# Altium schematic sheet Sheet1.SchDoc: FHGR_A3_landscape
size A3; Date: 18.07.2017; DrawnBy: G.P. Catregn; Organization: HTW Chur; Address1: Pulvermühlestrasse 57; Address2: 7004 Chur; Address3: Switzerland; DocumentNumber: 1; Revision: V1.0; SheetNumber: 1; SheetTotal: 2; DocumentName: HTW Template
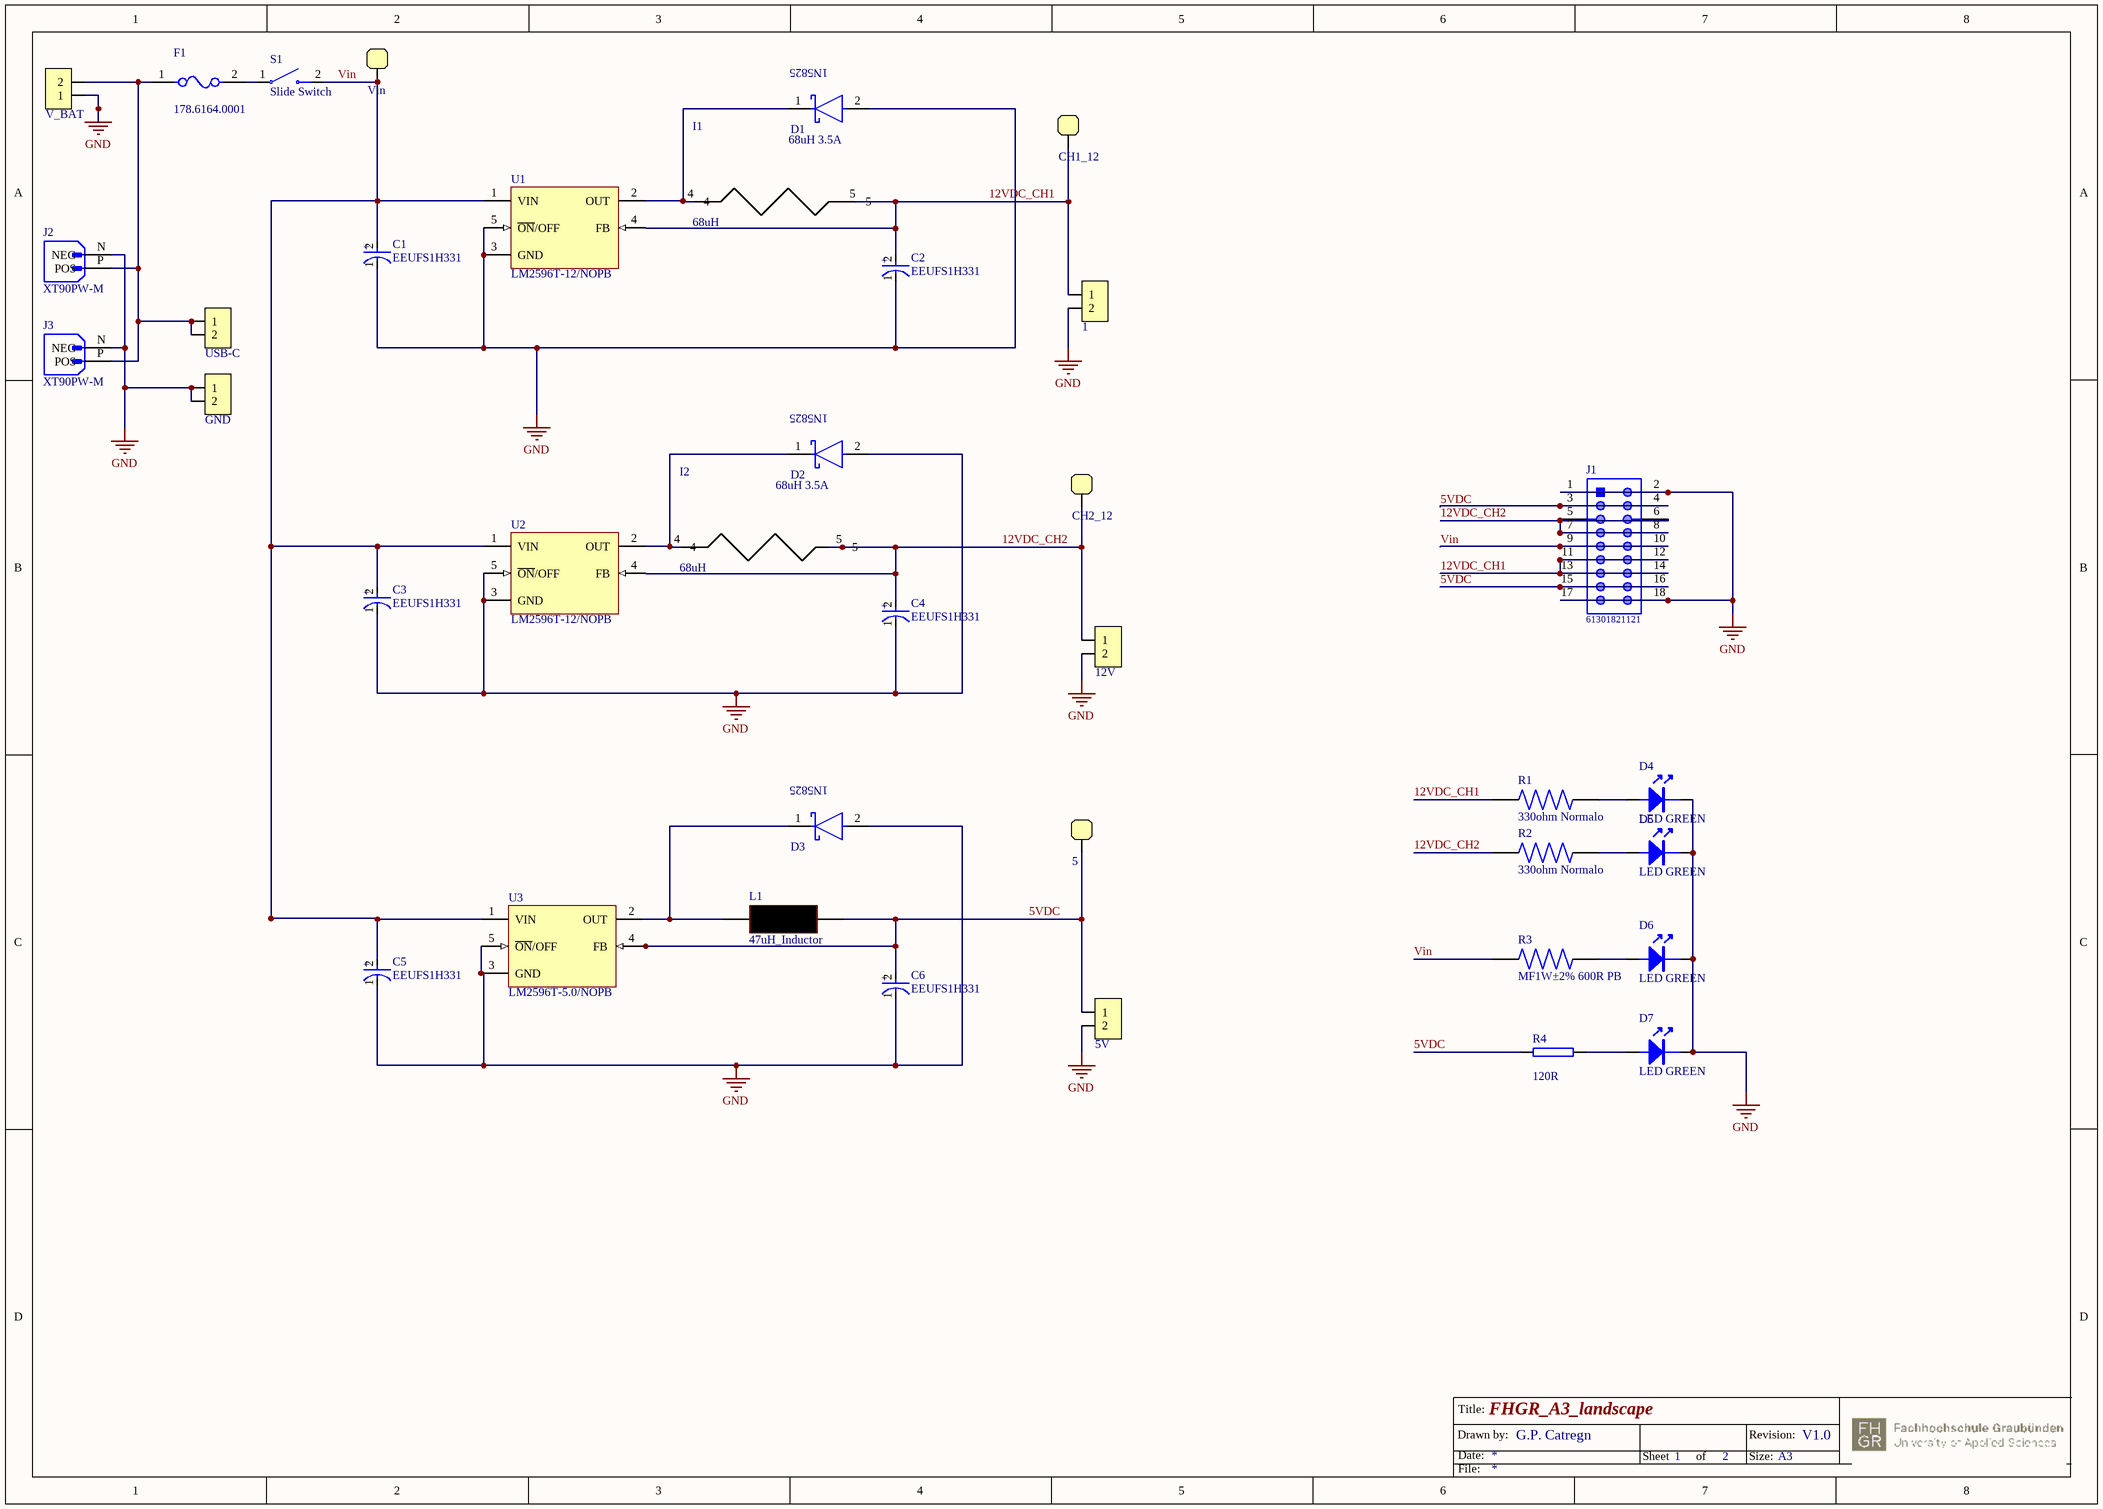
[diagram p0: Sheet1.SchDoc]

## Parts
1  2Pin_Female  [OSTTE020104]  (value not drawn)
5  MP  [MP_20]  (value not drawn)
5V  2Pin_Female  [OSTTE020104]  (value not drawn)
12V  2Pin_Female  [OSTTE020104]  (value not drawn)
C1  EEUFS1H331  [FP-RAD-TH-D_10_0_5-L_20_2-MFG]
C2  EEUFS1H331  [FP-RAD-TH-D_10_0_5-L_20_2-MFG]
C3  EEUFS1H331  [FP-RAD-TH-D_10_0_5-L_20_2-MFG]
C4  EEUFS1H331  [FP-RAD-TH-D_10_0_5-L_20_2-MFG]
C5  EEUFS1H331  [FP-RAD-TH-D_10_0_5-L_20_2-MFG]
C6  EEUFS1H331  [FP-RAD-TH-D_10_0_5-L_20_2-MFG]
CH1_12  MP  [MP_20]  (value not drawn)
CH2_12  MP  [MP_20]  (value not drawn)
D1  1N5825  [Microsemi_1N5825_0]  (value not drawn)
D2  1N5825  [Microsemi_1N5825_0]  (value not drawn)
D3  1N5825  [Microsemi_1N5825_0]  (value not drawn)
D4  LED GREEN  [LED_1206]
D5  LED GREEN  [LED_1206]
D6  LED GREEN  [LED_1206]
D7  LED GREEN  [LED_1206]
F1  178.6164.0001  [FP-178_6164_0001-MFG]
GND  2Pin_Male  [Header1x2_254]  (value not drawn)
I1  68uH  [PCBComponent_1]
I2  68uH  [PCBComponent_1]
J1  61301821121  [61301821121]
J2  XT90PW-M  [AMASS_XT90PW-M]
J3  XT90PW-M  [AMASS_XT90PW-M]
L1  47uH_Inductor  [INDM120120X100N]
R1  330ohm Normalo  [RESAD1100W55L680D260]
R2  330ohm Normalo  [RESAD1100W55L680D260]
R3  MF1W±2% 600R PB  [RESAD1100W55L680D260]
R4  value 120R  [0805]  (hidden comment: R 120R 0805)
S1  Slide Switch  [SW_GF_123_0054]
U1  LM2596T-12/NOPB  [NDH0005A]
U2  LM2596T-12/NOPB  [NDH0005A]
U3  LM2596T-5.0/NOPB  [NDH0005A]
USB-C  2Pin_Male  [Header1x2_254]  (value not drawn)
V_BAT  2Pin_Female  [OSTTE020104]  (value not drawn)
Vin  MP  [MP_20]  (value not drawn)

## Nets
GND: 1.2 5V.2 12V.2 C1.1(C) C2.1(C) C3.1(C) C4.1(C) C5.1(C) C6.1(C) D1.2(A) D2.2(A) D3.2(A) D4.K D5.K D6.K D7.K GND.1 GND.2 J1.1 J1.2 J1.17 J1.18 J2.N(NEG) J3.N(NEG) U1.3(GND) U1.5(~{ON}/OFF) U2.3(GND) U2.5(~{ON}/OFF) U3.3(GND) U3.5(~{ON}/OFF) V_BAT.1
5VDC: 5.1 5V.1 C6.2(A) J1.3 J1.4 J1.15 J1.16 L1.2 R4.1 U3.4(FB)
12VDC_CH1: 1.1 C2.2(A) CH1_12.1 I1.5 J1.11 J1.12 J1.13 J1.14 R1.1 U1.4(FB)
12VDC_CH2: 12V.1 C4.2(A) CH2_12.1 I2.5 J1.5 J1.6 J1.7 J1.8 R2.1 U2.4(FB)
Vin: C1.2(A) C3.2(A) C5.2(A) J1.9 J1.10 R3.1 S1.2(C) U1.1(VIN) U2.1(VIN) U3.1(VIN) Vin.1
NetD1_1: D1.1(C) I1.4 U1.2(OUT)
NetD2_1: D2.1(C) I2.4 U2.2(OUT)
NetD3_1: D3.1(C) L1.1 U3.2(OUT)
NetD4_A: D4.A R1.2
NetD5_A: D5.A R2.2
NetD6_A: D6.A R3.2
NetD7_A: D7.A R4.2
NetF1_1: F1.1 J2.P(POS) J3.P(POS) USB-C.1 USB-C.2 V_BAT.2
NetF1_2: F1.2 S1.1(A)

## Notes on the sheet
- Drawn by:
- Title:
- Date:
- Sheet
- of
- Size:
- Revision:
- A3
- File:
- (in symbol CMP-05427-000839-1) +
- (in symbol Component_1) 68uH 3.5A

## Library data of the parts
1 5V 12V V_BAT = Terminal_2Pin: Part ID: Terminal_2Pin; Price 1pc (CHF): 0.69; Supplier 1: Digi-Key; ComponentLink1Description: Datasheet; ComponentLink1URL: https://www.on-shore.com/wp-content/uploads/OSTTEXX0104.pdf; Supplier Part Number 1: ED2740-ND
5 CH1_12 CH2_12 Vin = Measurement_Pad: Part ID: Measurement_Pad
C1-C6 = CMP-05427-000839-1: Aluminum Electrolytic Capacitors (Radial Lead Type) 330uF ±20% 50V; RoHS Compliant: Yes
D4-D7 = LED_GREEN_1206: Peak Wavelenght: 565nm; Part ID: LED_GREEN_1206; Price 10pcs: 0.226; Supplier 1: Digi-Key; Supplier Part Number 1: 67-1357-1-ND; ComponentLink1Description: Datasheet; ComponentLink1URL: https://media.digikey.com/pdf/Data%20Sheets/Lite-On%20PDFs/LTST-C230KGKT.pdf
F1 = CMP-08604-000013-1: FUSE HOLDER BLADE 80V PCB; Manufacturer: Littelfuse Inc; Number Of Fuses: 1; Description: Fuse Holder  80V 1 Circuit Blade Through Hole; Conn Orientation: Vertical; Package: 0; Device Class L1: Circuit Protection; Category: Fuse; Digikey Description: FUSE HOLDER BLADE 80V PCB; RoHS: TRUE; ComponentLink2Description: Datasheet; ComponentLink2URL: https://www.littelfuse.com/~/media/commercial-vehicle/datasheets/automotive-fuse-holders/ato/littelfuse-fuse-holder-ato-flr-pcb-datasheet.pdf; Temperature Range High: +130°C; Lead Free: Yes; Voltage Rating Ac: 80V; Mouser Description: Fuse Holder HOLDER FOR FLR (ATO) PCB 1-PIN; Manufacturer Part Number: 178.6164.0001; Height: 17.5mm; Device Class L3: unset; Octopart: https://octopart.com/178.6164.0001-littelfuse-44502275; Automotive: No; Voltage Rating Dc: 80V; Device Class L2: Fuse Holders; Temperature: to +130°C
GND USB-C = Header_2: Part ID: Header_2; Price 1pc (CHF): 0.13; Supplier 1: Digi-Key; ComponentLink1Description: Datasheet; ComponentLink1URL: https://katalog.we-online.de/em/datasheet/6130xx11121.pdf; Supplier Part Number 1: 732-5315-ND
I1 I2 = Component_1
J1 = CMP-1502-01101-1: THT Vertical Pin Header WR-PHD, Pitch 2.54 mm, Dual Row, 18 pins; Manufacturer: Wurth Elektronik; Withstanding Voltage: 500VAC; Pin Number: 18; Pitch: 2.54mm; Rated Current: 3A; Contact Resistance: 20mOhm; Gender: Male; Working Voltage: 250VAC; Publisher: WurthElektronik; Packaging: Bag; Row Number: Dual; Datasheet URL: https://katalog.we-online.de/em/datasheet/6130xx21121.pdf; Mounting Technology: THT; Orientation: Vertical; Part Number: 61301821121; Package Reference: 61301821121; Manufacturer URL: http://www.we-online.de; Operating Temperature: -40to105degC
J2 J3 = XT90PW-M: Socket; DC supply; XT90; male; PIN: 2; on PCBs; THT; Colour: yellow; MF: AMASS; MP: XT90PW-M; Package: Package; Availability: Not in stock; Value: *; Price: None; Check_prices: https://www.snapeda.com/parts/XT90PW-M/AMASS/view-part/?ref=eda; SnapEDA_Link: https://www.snapeda.com/parts/XT90PW-M/AMASS/view-part/?ref=snap
L1 = YPRH1209_47uH_Inductor: Inductor 47uH
R1-R3 = MFR-25FBF52-1K: 1.07 kOhms Â±1% 0.25W, 1/4W Through Hole Resistor Axial - Metal Film; MF: Yageo; Value: *; SnapEDA_Link: https://www.snapeda.com/parts/MFR-25FBF52-1K/Yageo/view-part/?ref=snap; Purchase-URL: https://pricing.snapeda.com/search/part/MFR-25FBF52-1K/?ref=eda; Availability: In Stock; Price: None; Package: Axial Yageo; Check_prices: https://www.snapeda.com/parts/MFR-25FBF52-1K/Yageo/view-part/?ref=eda; MP: MFR-25FBF52-1K
R4 = R_120R_0805: Tolerance: 1%; Power Dissipation: 125mW; Part ID: R_120R_0805; Price 10pcs (CHF): 0.046; Supplier 1: Digi-Key; Supplier Part Number 1: A129738CT-ND
S1 = Slide_Switch: Voltage: 125V; Current: 8.5A; Part ID: Slide_Switch; Price 1pc (CHF): 1.17; Dimension: 10mmx16.5mmx8.8mm; Supplier 1: Digi-Key; ComponentLink1Description: Datasheet; ComponentLink1URL: https://media.digikey.com/pdf/Data%20Sheets/CW%20Industries%20PDFs/GF-123-0054_Dwg.pdf; Supplier Part Number 1: CWI333-ND
U1 U2 = CMP-0069-01925-3: SIMPLE SWITCHER® Power Converter 150 KHz 3A Step-Down Voltage Regulator, 5-pin TO-220, Pb-Free; Manufacturer: Texas Instruments; PackageTopMarking: NSUZXYTTE#*LM2596T*-12 P+; PowerWise: N; RoHS: Y; ComponentLink1URL: http://www.ti.com/general/docs/lit/getliterature.tsp?genericPartNumber=LM2596&fileType=pdf; CompType: Switcher; ComponentLink1Description: Datasheet URL; PackageReference: NDH0005A; PinCount: 5; PackageDescription: TO-220, Molded, Stagger Bend, 5 Lead
U3 = CMP-0069-01926-3: SIMPLE SWITCHER® Power Converter 150 KHz 3A Step-Down Voltage Regulator, 5-pin TO-220, Pb-Free; Manufacturer: Texas Instruments; PowerWise: N; PackageTopMarking: NSUZXYTTE#*LM2596T*-5.0 P+; ComponentLink1URL: http://www.ti.com/general/docs/lit/getliterature.tsp?genericPartNumber=LM2596&fileType=pdf; PackageDescription: TO-220, Molded, Stagger Bend, 5 Lead; ComponentLink1Description: Datasheet URL; PinCount: 5; RoHS: Y; CompType: Switcher; PackageReference: NDH0005A